# EAGLE schematic NICBP v3 (EAGLE 8.1.0)

## Sheet 1 of 4
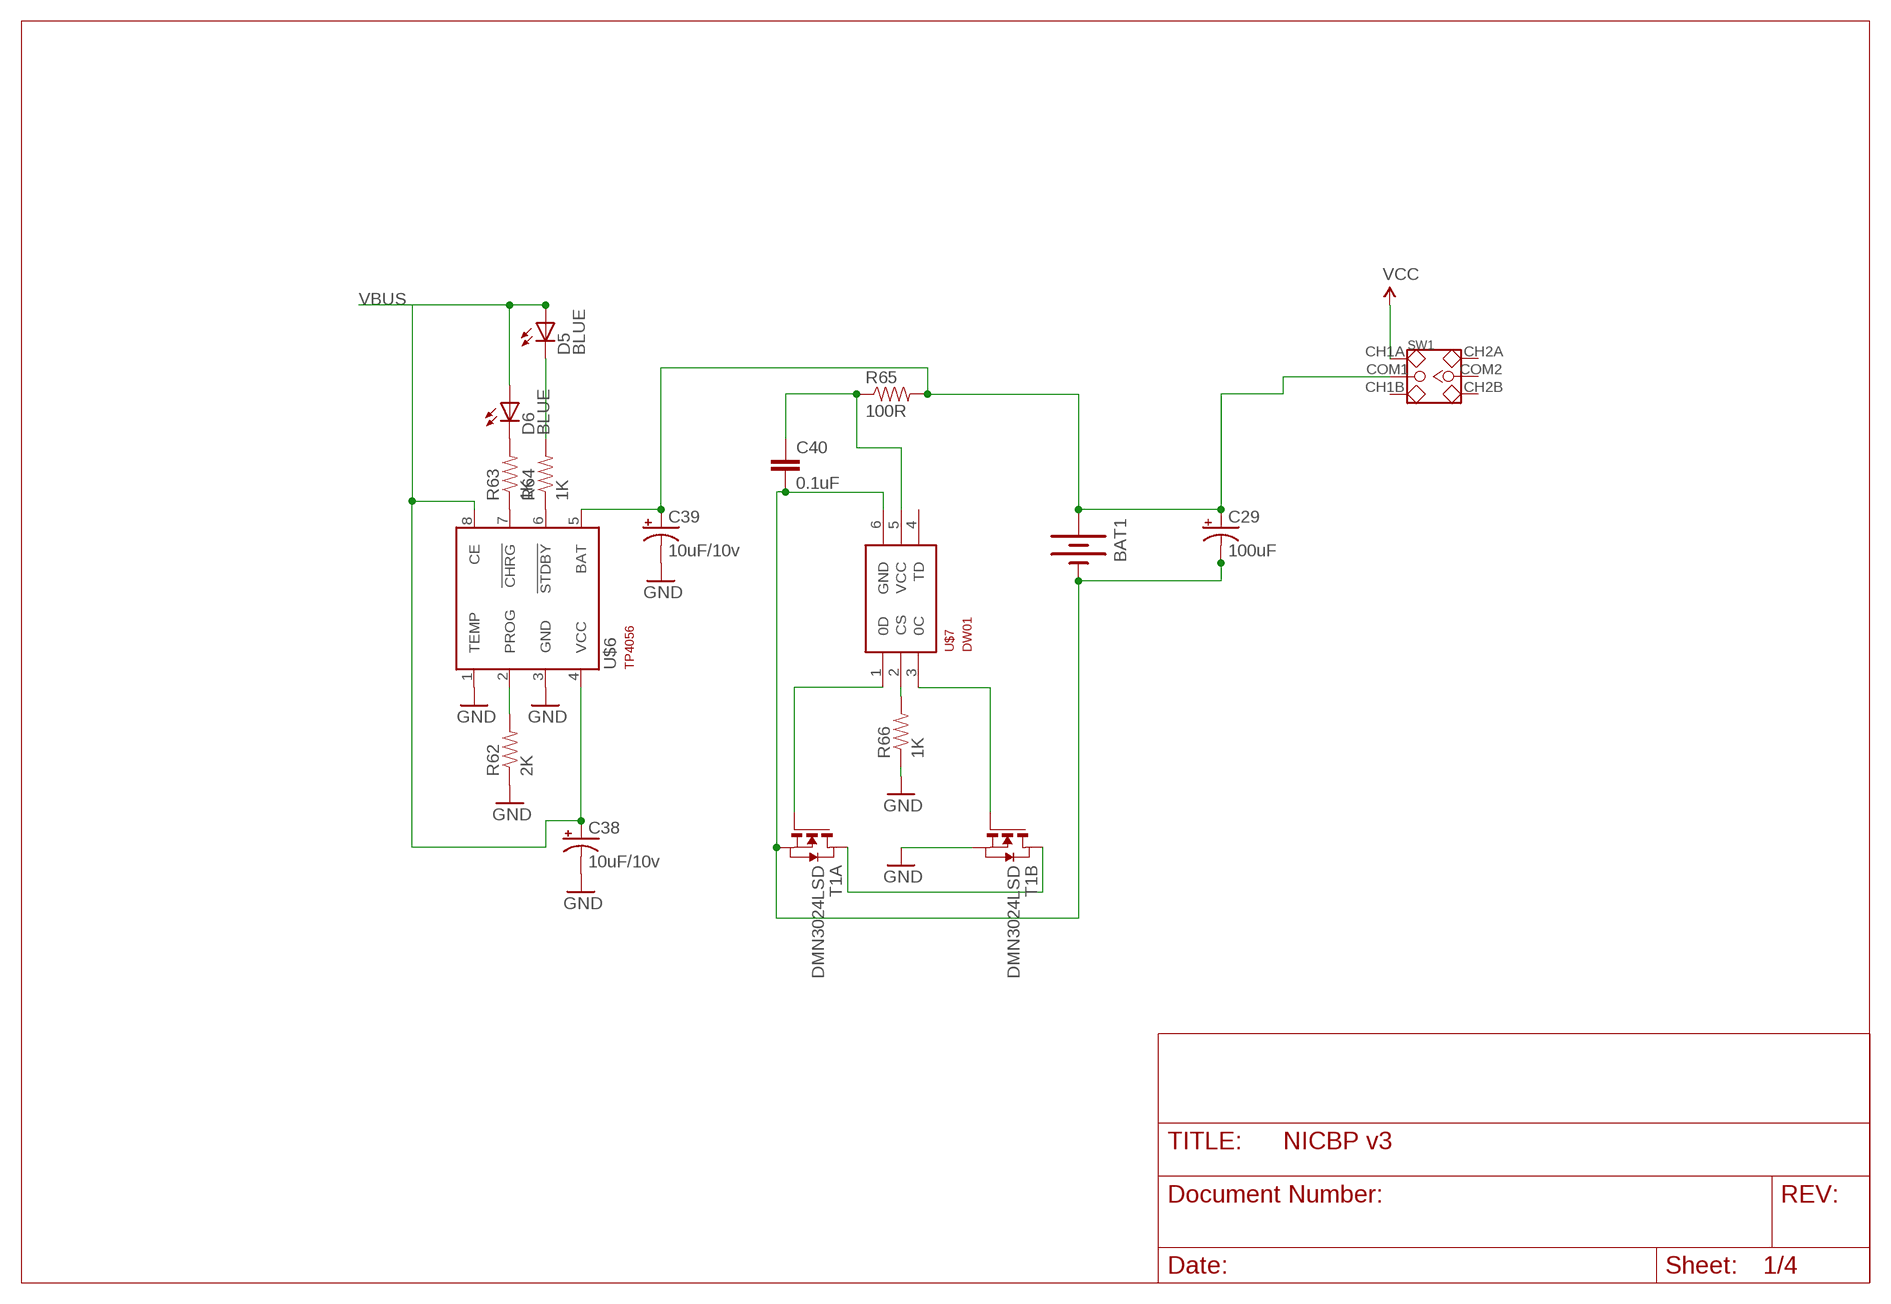
[diagram p0: schematic, sheet 1]

### Parts
BAT1  BATTERYLIPO-TABS  [LIPO-110-TABS]
C29  100uF  CAP_POLF80  [NIPPON_F80]
C38  10uF/10v  CAP_POL1206-KIT  [EIA3216-KIT]
C39  10uF/10v  CAP_POL1206-KIT  [EIA3216-KIT]
C40  0.1uF  0.1UF-100V-10%(0603)  [0603-CAP]
D5  BLUE  LED-BLUE0603  [LED-0603]
D6  BLUE  LED-BLUE0603  [LED-0603]
R62  2K  1KOHM1/10W1%(0603)  [0603-RES]
R63  1K  1KOHM1/10W1%(0603)  [0603-RES]
R64  1K  1KOHM1/10W1%(0603)  [0603-RES]
R65  100R  1KOHM1/10W1%(0603)  [0603-RES]
R66  1K  1KOHM1/10W1%(0603)  [0603-RES]
SW1  SMD-TOGGLE-SWITCH-2CH(2X3P-7X3.5MM)  [SW6-2.54-SMD-7.0X3.5X1.5MM]
T1  DMN3024LSD  [TSSOP-8]
U$6  TP4056  [SOT23-8]
U$7  DW01  [SOT23-6]

### Nets
GND: C38.C(-) C39.C(-) R62.1 R66.1 T1.6(B:S) T1.7(B:S) U$6.1(TEMP) U$6.3(GND) ; also sheet 2,3,4
N$1: BAT1.+ C29.+ C39.A(+) R65.2 SW1.COM1 U$6.5(BAT)
N$58: R62.2 U$6.2(PROG)
N$59: R63.1 U$6.7(!CHRG)
N$60: R64.1 U$6.6(!STDBY)
N$61: D6.C R63.2
N$62: D5.C R64.2
N$65: C40.1 R65.1 U$7.5(VCC)
N$66: BAT1.- C29.- C40.2 T1.2(A:S) T1.3(A:S) U$7.6(GND)
N$67: T1.4(A:G) U$7.1(0D)
N$68: R66.2 U$7.2(CS)
N$69: T1.1(A:D) T1.8(B:D)
N$70: T1.5(B:G) U$7.3(0C)
VBUS: C38.A(+) D5.A D6.A U$6.4(VCC) U$6.8(CE) ; also sheet 2
VCC: SW1.CH1A ; also sheet 2,3,4
Unconnected: SW1.CH1B SW1.CH2A SW1.CH2B SW1.COM2 U$7.4(TD)

## Sheet 2 of 4
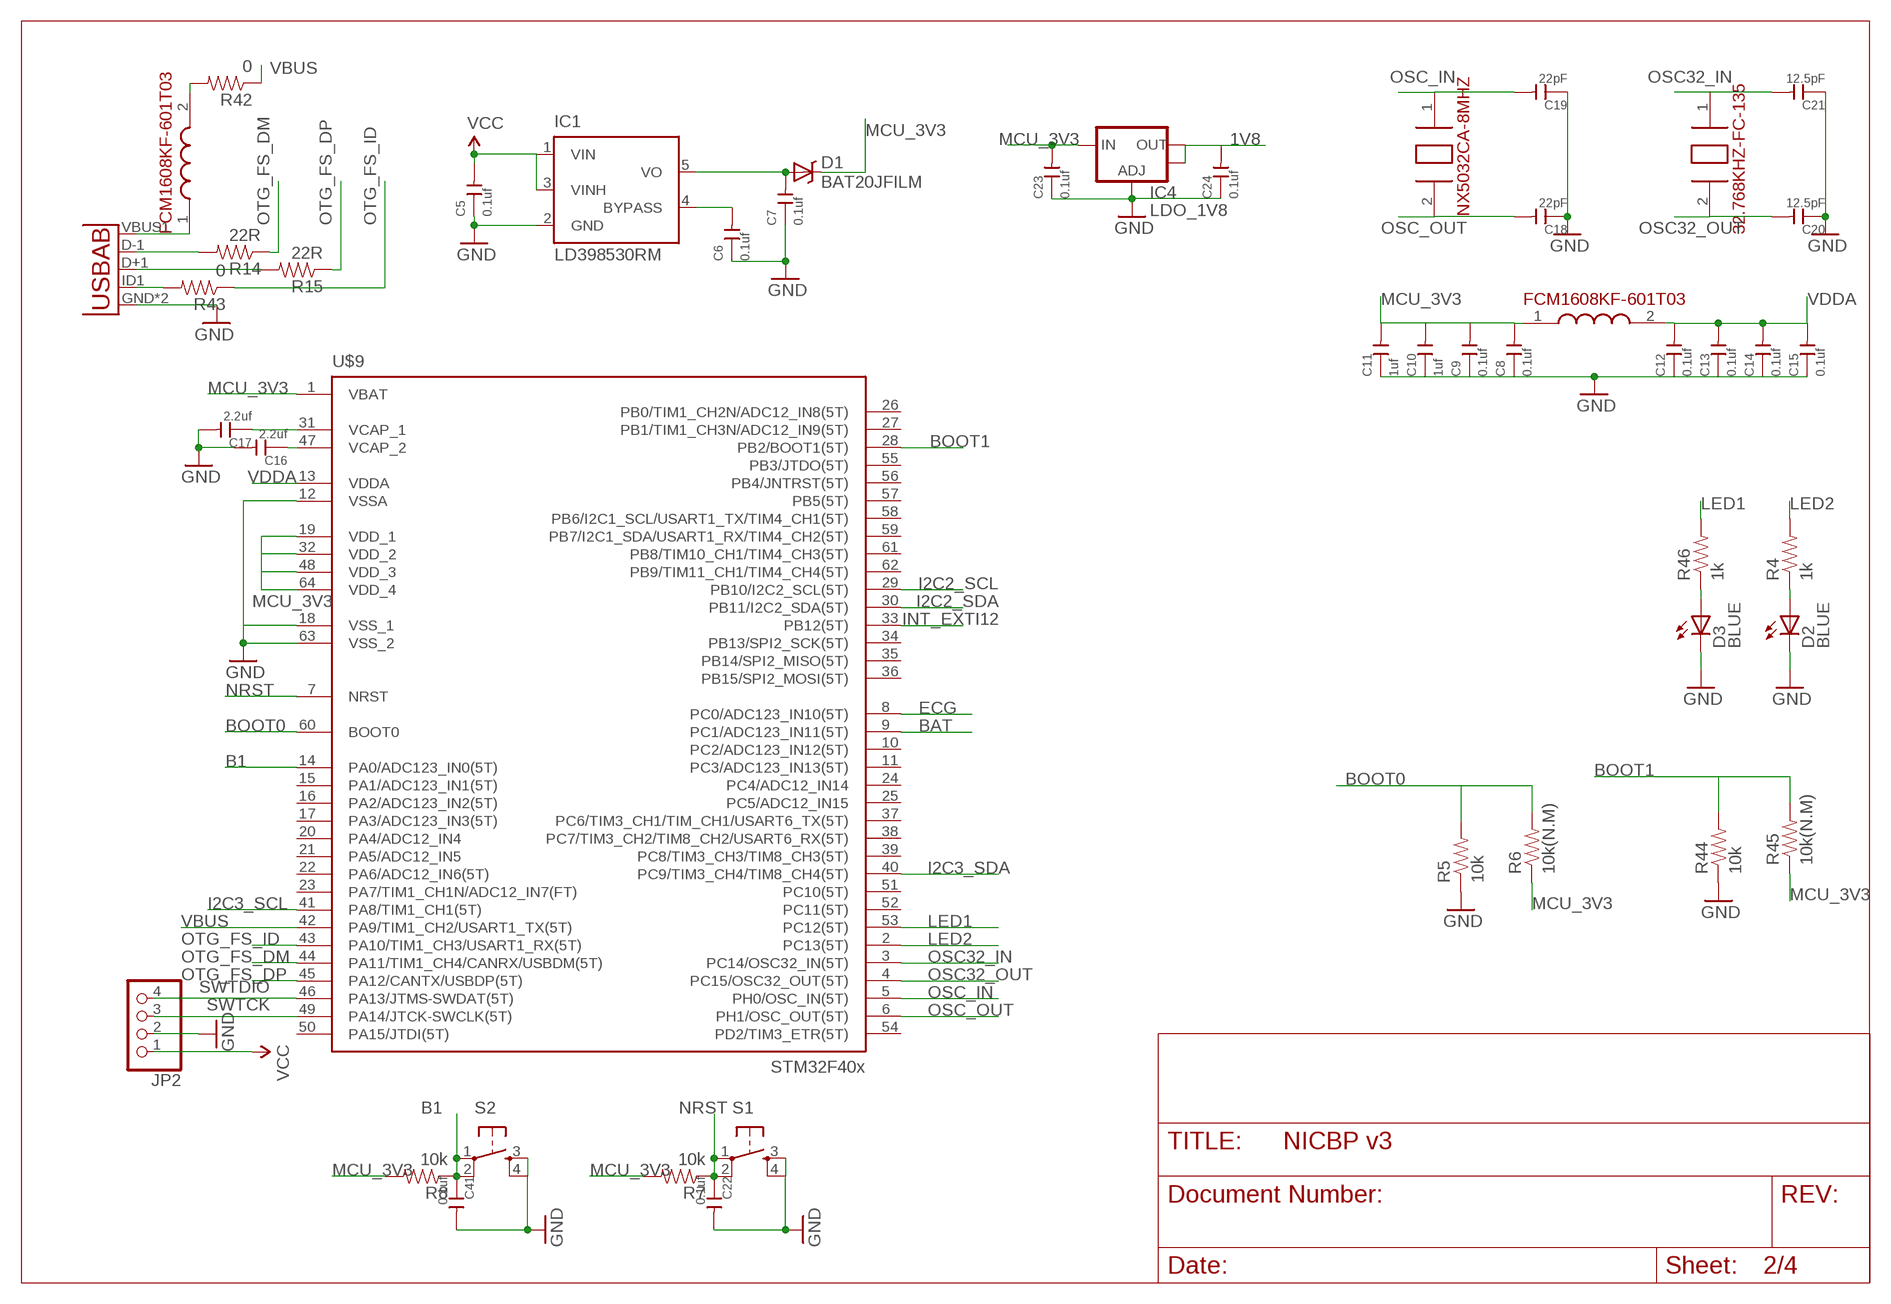
[diagram p1: schematic, sheet 2]

### Parts
C5  0.1uf  CERAMIC-4.7UF-10V-10%-X5R(0603)  [C0603]
C6  0.1uf  CERAMIC-4.7UF-10V-10%-X5R(0603)  [C0603]
C7  0.1uf  CERAMIC-4.7UF-10V-10%-X5R(0603)  [C0603]
C8  0.1uf  CERAMIC-4.7UF-10V-10%-X5R(0603)  [C0603]
C9  0.1uf  CERAMIC-4.7UF-10V-10%-X5R(0603)  [C0603]
C10  1uf  CERAMIC-4.7UF-10V-10%-X5R(0603)  [C0603]
C11  1uf  CERAMIC-4.7UF-10V-10%-X5R(0603)  [C0603]
C12  0.1uf  CERAMIC-4.7UF-10V-10%-X5R(0603)  [C0603]
C13  0.1uf  CERAMIC-4.7UF-10V-10%-X5R(0603)  [C0603]
C14  0.1uf  CERAMIC-4.7UF-10V-10%-X5R(0603)  [C0603]
C15  0.1uf  CERAMIC-4.7UF-10V-10%-X5R(0603)  [C0603]
C16  2.2uf  CERAMIC-4.7UF-10V-10%-X5R(0603)  [C0603]
C17  2.2uf  CERAMIC-4.7UF-10V-10%-X5R(0603)  [C0603]
C18  22pF  CERAMIC-4.7UF-10V-10%-X5R(0603)  [C0603]
C19  22pF  CERAMIC-4.7UF-10V-10%-X5R(0603)  [C0603]
C20  12.5pF  CERAMIC-4.7UF-10V-10%-X5R(0603)  [C0603]
C21  12.5pF  CERAMIC-4.7UF-10V-10%-X5R(0603)  [C0603]
C22  0.1uf  CERAMIC-4.7UF-10V-10%-X5R(0603)  [C0603]
C23  0.1uf  CERAMIC-4.7UF-10V-10%-X5R(0603)  [C0603]
C24  0.1uf  CERAMIC-4.7UF-10V-10%-X5R(0603)  [C0603]
C41  0.1uf  CERAMIC-4.7UF-10V-10%-X5R(0603)  [C0603]
D1  BAT20JFILM  [SOD-323]
D2  BLUE  LED-BLUE0603  [LED-0603]
D3  BLUE  LED-BLUE0603  [LED-0603]
IC1  LD398530RM  [SOT23-5L]
IC4  LDO_1V8  V_REG_LM1117SOT223  [SOT223]
JP2  PINHD-1X4  [1X04]
R4  1k  0OHM1/10W5%(0603)  [0603]
R5  10k  0OHM1/10W5%(0603)  [0603]
R6  10k(N.M)  0OHM1/10W5%(0603)  [0603]
R7  10k  0OHM1/10W5%(0603)  [0603]
R8  10k  0OHM1/10W5%(0603)  [0603]
R14  22R  390OHM1/10W1%(0603)  [0603-RES]
R15  22R  390OHM1/10W1%(0603)  [0603-RES]
R42  0  390OHM1/10W1%(0603)  [0603-RES]
R43  0  390OHM1/10W1%(0603)  [0603-RES]
R44  10k  0OHM1/10W5%(0603)  [0603]
R45  10k(N.M)  0OHM1/10W5%(0603)  [0603]
R46  1k  0OHM1/10W5%(0603)  [0603]
S1  TAC_SWITCHSMD  [TACTILE_SWITCH_SMD]
S2  TAC_SWITCHSMD  [TACTILE_SWITCH_SMD]
U1  USB""  [USB-MICRO-SMD]
U$2  NX5032CA-8MHZ  [NX5032CA-8MHZ]
U$3  FCM1608KF-601T03  [FCM1608KF-601T03]
U$4  32.768KHZ-FC-135  [32.768KHZ-FC-135]
U$9  STM32F405R  [TQFP64]
U$15  FCM1608KF-601T03  [FCM1608KF-601T03]

### Nets
1V8: C24.2 IC4.2(OUT) IC4.4(OUT) ; also sheet 4
B1: C41.1 R8.1 S2.1 S2.2 U$9.14(PA0/ADC123_IN0(5T))
BAT: U$9.9(PC1/ADC123_IN11(5T)) ; also sheet 3
BOOT0: R5.2 R6.2 U$9.60(BOOT0)
BOOT1: R44.2 R45.2 U$9.28(PB2/BOOT1(5T))
ECG: U$9.8(PC0/ADC123_IN10(5T)) ; also sheet 3
GND: C5.1 C6.1 C7.1 C8.1 C9.1 C10.1 C11.1 C12.1 C13.1 C14.1 C15.1 C16.2 C17.2 C18.1 C19.1 C20.1 C21.1 C22.2 C23.1 C24.1 C41.2 D2.C D3.C IC1.2(GND) IC4.1(ADJ) JP2.2 R5.1 R44.1 S1.3 S1.4 S2.3 S2.4 U1.GND U1.GND1(GND) U$9.12(VSSA) U$9.18(VSS_1) U$9.63(VSS_2) ; also sheet 1,3,4
I2C2_SCL: U$9.29(PB10/I2C2_SCL(5T)) ; also sheet 4
I2C2_SDA: U$9.30(PB11/I2C2_SDA(5T)) ; also sheet 4
I2C3_SCL: U$9.41(PA8/TIM1_CH1(5T)) ; also sheet 4
I2C3_SDA: U$9.40(PC9/TIM3_CH4/TIM8_CH4(5T)) ; also sheet 4
INT_EXTI12: U$9.33(PB12(5T)) ; also sheet 4
LED1: R46.2 U$9.53(PC12(5T))
LED2: R4.2 U$9.2(PC13(5T))
MCU_3V3: C8.2 C9.2 C10.2 C11.2 C23.2 D1.1(C) IC4.3(IN) R6.1 R7.2 R8.2 R45.1 U$3.1(1.IN) U$9.1(VBAT) U$9.19(VDD_1) U$9.32(VDD_2) U$9.48(VDD_3) U$9.64(VDD_4) ; also sheet 3,4
N$2: D2.A R4.1
N$3: C17.1 U$9.31(VCAP_1)
N$5: C16.1 U$9.47(VCAP_2)
N$6: C6.2 IC1.4(BYPASS)
N$7: C7.2 D1.2(A) IC1.5(VO)
N$13: R14.2 U1.D-1(D-)
N$23: R15.2 U1.D+1(D+)
N$45: R43.2 U1.ID1(USBID)
N$46: U1.VBUS1(VBUS) U$15.1(1.IN)
N$47: R42.2 U$15.2(2.OUT)
N$48: D3.A R46.1
NRST: C22.1 R7.1 S1.1 S1.2 U$9.7(NRST)
OSC32_IN: C21.2 U$4.1(1.XIN) U$9.3(PC14/OSC32_IN(5T))
OSC32_OUT: C20.2 U$4.2(2.XIN) U$9.4(PC15/OSC32_OUT(5T))
OSC_IN: C19.2 U$2.1(1.XIN) U$9.5(PH0/OSC_IN(5T))
OSC_OUT: C18.2 U$2.2(2.XOUT) U$9.6(PH1/OSC_OUT(5T))
OTG_FS_DM: R14.1 U$9.44(PA11/TIM1_CH4/CANRX/USBDM(5T))
OTG_FS_DP: R15.1 U$9.45(PA12/CANTX/USBDP(5T))
OTG_FS_ID: R43.1 U$9.43(PA10/TIM1_CH3/USART1_RX(5T))
SWTCK: JP2.3 U$9.49(PA14/JTCK-SWCLK(5T))
SWTDIO: JP2.4 U$9.46(PA13/JTMS-SWDAT(5T))
VBUS: R42.1 U$9.42(PA9/TIM1_CH2/USART1_TX(5T)) ; also sheet 1
VCC: C5.2 IC1.1(VIN) IC1.3(VINH) JP2.1 ; also sheet 1,3,4
VDDA: C12.2 C13.2 C14.2 C15.2 U$3.2(2.OUT) U$9.13(VDDA)
Unconnected: U$9.10(PC2/ADC123_IN12(5T)) U$9.11(PC3/ADC123_IN13(5T)) U$9.15(PA1/ADC123_IN1(5T)) U$9.16(PA2/ADC123_IN2(5T)) U$9.17(PA3/ADC123_IN3(5T)) U$9.20(PA4/ADC12_IN4) U$9.21(PA5/ADC12_IN5) U$9.22(PA6/ADC12_IN6(5T)) U$9.23(PA7/TIM1_CH1N/ADC12_IN7(FT)) U$9.24(PC4/ADC12_IN14) U$9.25(PC5/ADC12_IN15) U$9.26(PB0/TIM1_CH2N/ADC12_IN8(5T)) U$9.27(PB1/TIM1_CH3N/ADC12_IN9(5T)) U$9.34(PB13/SPI2_SCK(5T)) U$9.35(PB14/SPI2_MISO(5T)) U$9.36(PB15/SPI2_MOSI(5T)) U$9.37(PC6/TIM3_CH1/TIM_CH1/USART6_TX(5T)) U$9.38(PC7/TIM3_CH2/TIM8_CH2/USART6_RX(5T)) U$9.39(PC8/TIM3_CH3/TIM8_CH3(5T)) U$9.50(PA15/JTDI(5T)) U$9.51(PC10(5T)) U$9.52(PC11(5T)) U$9.54(PD2/TIM3_ETR(5T)) U$9.55(PB3/JTDO(5T)) U$9.56(PB4/JNTRST(5T)) U$9.57(PB5(5T)) U$9.58(PB6/I2C1_SCL/USART1_TX/TIM4_CH1(5T)) U$9.59(PB7/I2C1_SDA/USART1_RX/TIM4_CH2(5T)) U$9.61(PB8/TIM10_CH1/TIM4_CH3(5T)) U$9.62(PB9/TIM11_CH1/TIM4_CH4(5T))

## Sheet 3 of 4
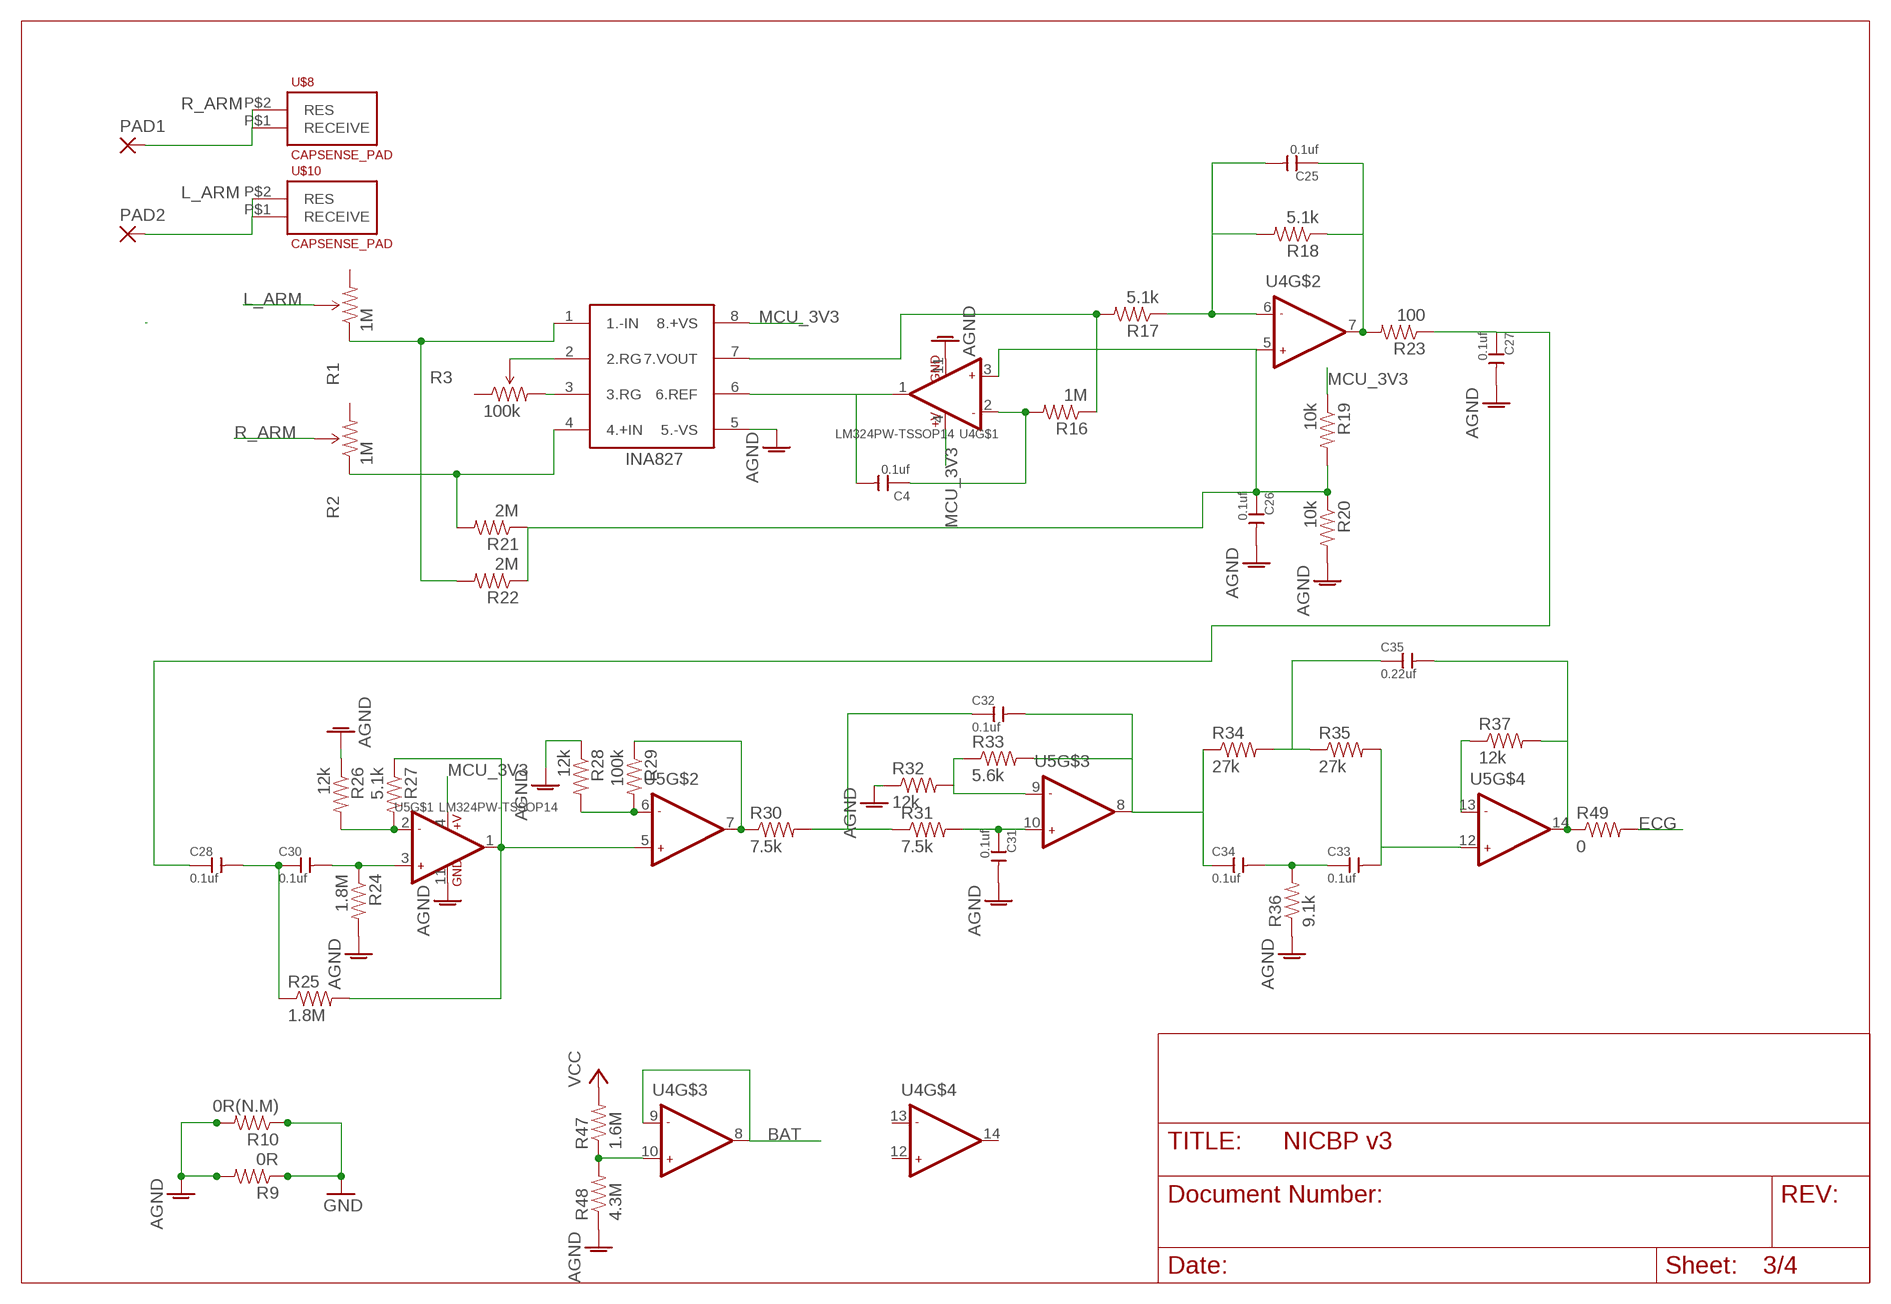
[diagram p2: schematic, sheet 3]

### Parts
C4  0.1uf  CERAMIC-4.7UF-10V-10%-X5R(0603)  [C0603]
C25  0.1uf  CERAMIC-4.7UF-10V-10%-X5R(0603)  [C0603]
C26  0.1uf  CERAMIC-4.7UF-10V-10%-X5R(0603)  [C0603]
C27  0.1uf  CERAMIC-4.7UF-10V-10%-X5R(0603)  [C0603]
C28  0.1uf  CERAMIC-4.7UF-10V-10%-X5R(0603)  [C0603]
C30  0.1uf  CERAMIC-4.7UF-10V-10%-X5R(0603)  [C0603]
C31  0.1uf  CERAMIC-4.7UF-10V-10%-X5R(0603)  [C0603]
C32  0.1uf  CERAMIC-4.7UF-10V-10%-X5R(0603)  [C0603]
C33  0.1uf  CERAMIC-4.7UF-10V-10%-X5R(0603)  [C0603]
C34  0.1uf  CERAMIC-4.7UF-10V-10%-X5R(0603)  [C0603]
C35  0.22uf  CERAMIC-4.7UF-10V-10%-X5R(0603)  [C0603]
PAD1  3,17/1,3  [3,17/1,3]
PAD2  3,17/1,3  [3,17/1,3]
R1  1M  TRIMPOT-2  [TRIMPOT_TC33]
R2  1M  TRIMPOT-2  [TRIMPOT_TC33]
R3  100k  TRIMPOT-2  [TRIMPOT_TC33]
R9  0R  0OHM1/10W5%(0603)  [0603]
R10  0R(N.M)  0OHM1/10W5%(0603)  [0603]
R16  1M  0OHM1/10W5%(0603)  [0603]
R17  5.1k  0OHM1/10W5%(0603)  [0603]
R18  5.1k  0OHM1/10W5%(0603)  [0603]
R19  10k  0OHM1/10W5%(0603)  [0603]
R20  10k  0OHM1/10W5%(0603)  [0603]
R21  2M  0OHM1/10W5%(0603)  [0603]
R22  2M  0OHM1/10W5%(0603)  [0603]
R23  100  0OHM1/10W5%(0603)  [0603]
R24  1.8M  0OHM1/10W5%(0603)  [0603]
R25  1.8M  0OHM1/10W5%(0603)  [0603]
R26  12k  0OHM1/10W5%(0603)  [0603]
R27  5.1k  0OHM1/10W5%(0603)  [0603]
R28  12k  0OHM1/10W5%(0603)  [0603]
R29  100k  0OHM1/10W5%(0603)  [0603]
R30  7.5k  0OHM1/10W5%(0603)  [0603]
R31  7.5k  0OHM1/10W5%(0603)  [0603]
R32  12k  0OHM1/10W5%(0603)  [0603]
R33  5.6k  0OHM1/10W5%(0603)  [0603]
R34  27k  0OHM1/10W5%(0603)  [0603]
R35  27k  0OHM1/10W5%(0603)  [0603]
R36  9.1k  0OHM1/10W5%(0603)  [0603]
R37  12k  0OHM1/10W5%(0603)  [0603]
R47  1.6M  0OHM1/10W5%(0603)  [0603]
R48  4.3M  0OHM1/10W5%(0603)  [0603]
R49  0  0OHM1/10W5%(0603)  [0603]
U4  LM324PW-TSSOP14  AMPLIFIER-LM324PW(TSSOP14)  [TSSOP14-0.65-5X4.4MM]
U5  LM324PW-TSSOP14  AMPLIFIER-LM324PW(TSSOP14)  [TSSOP14-0.65-5X4.4MM]
U$5  INA827  [INA827]
U$8  CAPSENSE_PAD  [CAPSENSE_PAD]
U$10  CAPSENSE_PAD  [CAPSENSE_PAD]

### Nets
ADC1: C35.2 R37.2 R49.1 U5.14(OUT2)
AGND: C26.2 C27.2 C31.2 R9.2 R10.2 R20.2 R24.2 R26.1 R28.1 R32.1 R36.1 R48.1 U4.11(GND) U5.11(GND) U$5.5(5.-VS)
BAT: U4.8(OUT2) U4.9(-IN2) ; also sheet 2
ECG: R49.2 ; also sheet 2
GND: R9.1 R10.1 ; also sheet 1,2,4
L_ARM: PAD2.1(P) R1.2(WIPER) U$10.P$1(RECEIVE) U$10.P$2(RES)
MCU_3V3: R19.1 U4.4(+V) U5.4(+V) U$5.8(8.+VS) ; also sheet 2,4
N$8: C27.1 C28.1 R23.1
N$9: R47.1 R48.2 U4.10(+IN2)
N$14: R3.3(CW) U$5.3(3.RG)
N$15: R3.2(WIPER) U$5.2(2.RG)
N$16: R1.1(CCW) R22.2 U$5.1(1.-IN)
N$17: R2.1(CCW) R21.2 U$5.4(4.+IN)
N$18: C4.2 U4.1(OUT1) U$5.6(6.REF)
N$19: C4.1 R16.2 U4.2(-IN1)
N$20: R16.1 R17.2 U$5.7(7.VOUT)
N$21: C25.2 R17.1 R18.2 U4.6(-IN2)
N$22: C25.1 R18.1 R23.2 U4.7(OUT2)
N$24: C26.1 R19.2 R20.1 R21.1 R22.1 U4.3(+IN1) U4.5(+IN2)
N$25: R26.2 R27.2 U5.2(-IN1)
N$26: R25.2 R27.1 U5.1(OUT1) U5.5(+IN2)
N$27: C30.2 R24.1 U5.3(+IN1)
N$28: C28.2 C30.1 R25.1
N$29: R28.2 R29.2 U5.6(-IN2)
N$30: R29.1 R30.1 U5.7(OUT2)
N$31: C32.1 R30.2 R31.1
N$32: C31.1 R31.2 U5.10(+IN2)
N$33: C32.2 C34.1 R33.2 R34.1 U5.8(OUT2)
N$34: R32.2 R33.1 U5.9(-IN2)
N$35: C35.1 R34.2 R35.1
N$36: C33.1 C34.2 R36.2
N$37: C33.2 R35.2 U5.12(+IN2)
N$38: R37.1 U5.13(-IN2)
R_ARM: PAD1.1(P) R2.2(WIPER) U$8.P$1(RECEIVE) U$8.P$2(RES)
VCC: R47.2 ; also sheet 1,2,4
Unconnected: R1.3(CW) R2.3(CW) R3.1(CCW) U4.12(+IN2) U4.13(-IN2) U4.14(OUT2)

## Sheet 4 of 4
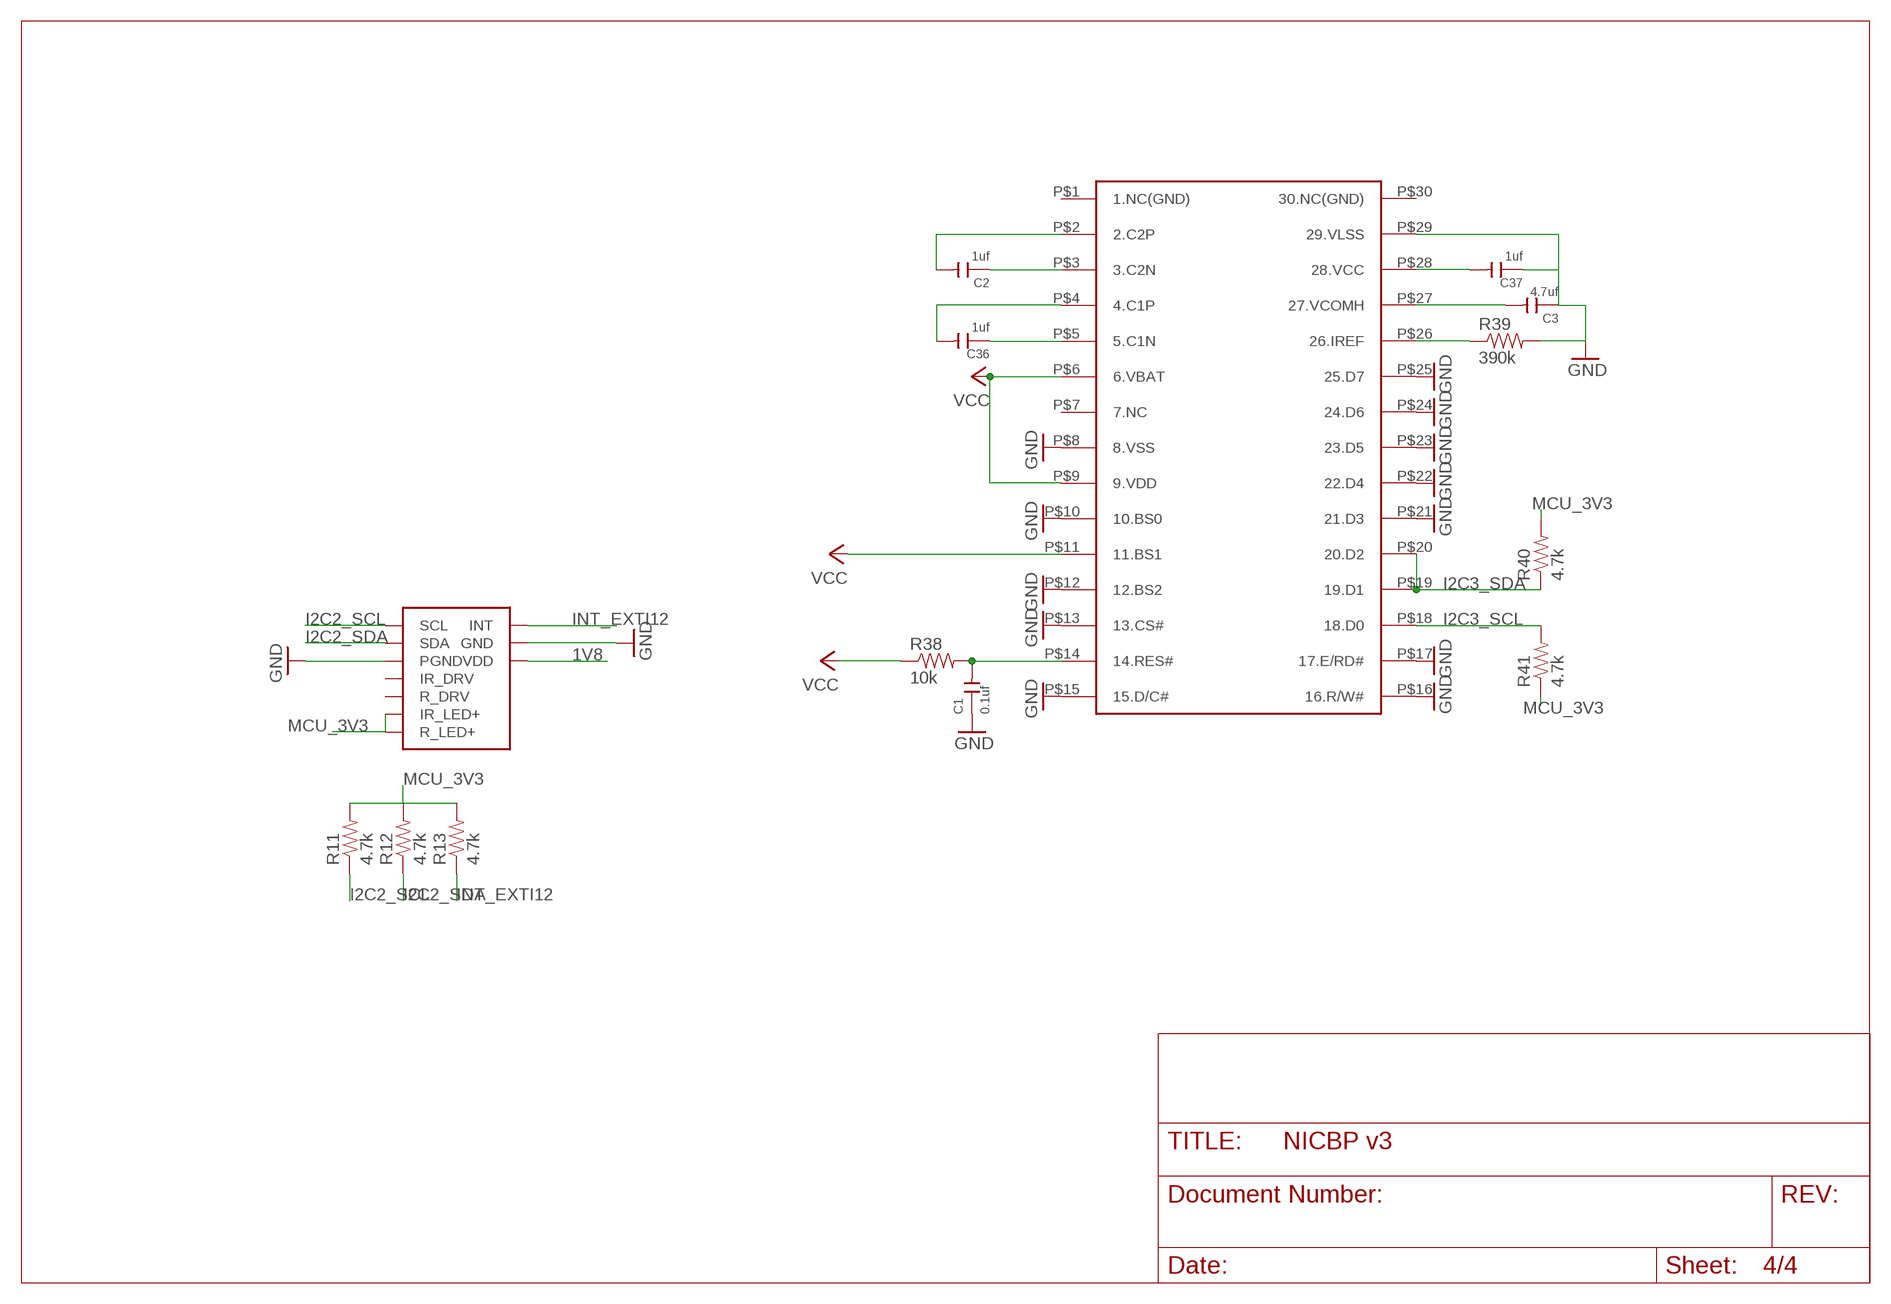
[diagram p3: schematic, sheet 4]

### Parts
C1  0.1uf  CERAMIC-4.7UF-10V-10%-X5R(0603)  [C0603]
C2  1uf  CERAMIC-4.7UF-10V-10%-X5R(0603)  [C0603]
C3  4.7uf  CERAMIC-4.7UF-10V-10%-X5R(0603)  [C0603]
C36  1uf  CERAMIC-4.7UF-10V-10%-X5R(0603)  [C0603]
C37  1uf  CERAMIC-4.7UF-10V-10%-X5R(0603)  [C0603]
R11  4.7k  0OHM1/10W5%(0603)  [0603]
R12  4.7k  0OHM1/10W5%(0603)  [0603]
R13  4.7k  0OHM1/10W5%(0603)  [0603]
R38  10k  0OHM1/10W5%(0603)  [0603]
R39  390k  0OHM1/10W5%(0603)  [0603]
R40  4.7k  0OHM1/10W5%(0603)  [0603]
R41  4.7k  0OHM1/10W5%(0603)  [0603]
U$12  MAX30100  [MAX30100]
U$13  ER-OLED0.96  [ER-OLED0.96]

### Nets
1V8: U$12.11(VDD) ; also sheet 2
GND: C1.1 C3.1 C37.1 R39.2 U$12.4(PGND) U$12.12(GND) U$13.P$8(8.VSS) U$13.P$10(10.BS0) U$13.P$12(12.BS2) U$13.P$13(13.CS#) U$13.P$15(15.D/C#) U$13.P$16(16.R/W#) U$13.P$17(17.E/RD#) U$13.P$21(21.D3) U$13.P$22(22.D4) U$13.P$23(23.D5) U$13.P$24(24.D6) U$13.P$25(25.D7) U$13.P$29(29.VLSS) ; also sheet 1,2,3
I2C2_SCL: R11.1 U$12.2(SCL) ; also sheet 2
I2C2_SDA: R12.1 U$12.3(SDA) ; also sheet 2
I2C3_SCL: R41.2 U$13.P$18(18.D0) ; also sheet 2
I2C3_SDA: R40.1 U$13.P$19(19.D1) U$13.P$20(20.D2) ; also sheet 2
INT_EXTI12: R13.1 U$12.13(INT) ; also sheet 2
MCU_3V3: R11.2 R12.2 R13.2 R40.2 R41.1 U$12.9(R_LED+) U$12.10(IR_LED+) ; also sheet 2,3
N$11: C1.2 R38.2 U$13.P$14(14.RES#)
N$12: C2.1 U$13.P$3(3.C2N)
N$39: C36.1 U$13.P$5(5.C1N)
N$40: C2.2 U$13.P$2(2.C2P)
N$41: C36.2 U$13.P$4(4.C1P)
N$42: R39.1 U$13.P$26(26.IREF)
N$43: C3.2 U$13.P$27(27.VCOMH)
N$44: C37.2 U$13.P$28(28.VCC)
VCC: R38.1 U$13.P$6(6.VBAT) U$13.P$9(9.VDD) U$13.P$11(11.BS1) ; also sheet 1,2,3
Unconnected: U$12.5(IR_DRV) U$12.6(R_DRV) U$13.P$1(1.NC(GND)) U$13.P$7(7.NC) U$13.P$30(30.NC(GND))

## Library data of the parts
BAT1 = SparkFun-Electromechanical:BATTERY: Battery Holders Various common sizes : AA, AAA, 20mm coin cell and 12mm coin cell. 20MM_4LEGS, BATT-10373
C1 C2 C4-C28 C30-C37 C41 = Seeed-OPL-Capacitor:CERAMIC-4.7UF-10V-10%-X5R(0603): 302010111; MPN: CC0603KRX5R6BB475; VALUE: 4.7uf
C3 = Seeed-OPL-Capacitor:CERAMIC-4.7UF-10V-10%-X5R(0603): 302010111; MPN: CC0603KRX5R6BB475
C29 C38 C39 = SparkFun-Capacitors:CAP_POL: Capacitor Polarized These are standard SMD and PTH capacitors. Normally 10uF, 47uF, and 100uF in electrolytic and tantalum varieties. Always verify the external diameter of the through hole cap, it varies with capacity, voltage, and manufacturer. The EIA devices should be standard.
C40 = SparkFun-Capacitors:0.1UF-100V-10%(0603): CAP-08390; PROD_ID: CAP-08390
D1 = SparkFun-DiscreteSemi:BAT20JFILM: 23V, 1A Schottky diode, SOD-323 package; PROD_ID: DIO-11623
D2 D3 D5 D6 = SparkFun-LED:LED-BLUE: Blue LEDs for production use Various blue LEDs stocked by SparkFun production 0603 - DIO-08575 Rebel - DIO-09553 1206 - DIO-09911; PROD_ID: DIO-08575
IC1 = st-microelectronics:LD3985: Ultra low drop and low noise BiCMOS voltage regulators Source: www.st.com LD3985.pdf
IC4 = SparkFun-PowerIC:V_REG_LM1117: Voltage Regulator LM1117 Standard adjustable voltage regulator but in SMD form. Spark Fun Electronics SKU : COM-00595
JP2 = pinhead:PINHD-1X4: PIN HEADER
PAD1 PAD2 = wirepad:3,17/1,3: THROUGH-HOLE PAD
R1-R3 = SparkFun-Electromechanical:TRIMPOT: Various small potentiometers for "set-and-forget" applications
R4-R13 R16-R41 R44-R48 = SparkFun-Resistors:0OHM1/10W5%(0603): RES-08609; PROD_ID: RES-08609; VALUE: 0
R14 R15 R42 R43 = SparkFun-Resistors:390OHM1/10W1%(0603): RES-07864; PROD_ID: RES-07864; VALUE: 390
R49 = SparkFun-Resistors:0OHM1/10W5%(0603): RES-08609; PROD_ID: RES-08609
R62 R65 = SparkFun-Resistors:1KOHM1/10W1%(0603): RES-07856; PROD_ID: RES-07856; VALUE: 1K
R63 R64 R66 = SparkFun-Resistors:1KOHM1/10W1%(0603): RES-07856; PROD_ID: RES-07856
S1 S2 = SparkFun-Electromechanical:TAC_SWITCH: Momentary Switch Button commonly used for reset or general input. Spark Fun Electronics SKU : COM-00097 SMT- SWCH-08247; PROD_ID: SWCH-08247
SW1 = Seeed-OPL-Switch:SMD-TOGGLE-SWITCH-2CH(2X3P-7X3.5MM): 311030005
T1 = FS8205A:DMN3024LSD: DUAL N-CHANNEL ENHANCEMENT MODE MOSFET data sheet <http://goo.gl/dRgboR> Dave.Calaway Eagle Library <https://goo.gl/Muy1Tr>
U1 = MicroUSB Long GND:USB: This is a USB AB connector that is compatible with USB OTG. i.e. this connector can serve as a host or device
U4 U5 = Seeed-OPL-ic:AMPLIFIER-LM324PW(TSSOP14): 310020008; MPN: LM324PW
U$2 = NX5032CA-8MHZ:NX5032CA-8MHZ
U$3 U$15 = FCM1608KF-601T03:FCM1608KF-601T03
U$4 = 32.768KHZ-FC-135:32.768KHZ-FC-135
U$5 = INA827:INA827
U$6 = TP4056:TP4056: TP4056 Data sheet <http://goo.gl/J7k8TF> Dave.Calaway Eagle Library <https://goo.gl/Muy1Tr>
U$7 = DW01:DW01: The DW01-P battery protection IC is designed to protect lithium-ion/polymer battery from damage or degrading the lifetime due to overcharge, overdischarge, and/or overcurrent for one-cell lithium-ion/polymer battery powered systems, such as cellular phones. Data sheet <http://goo.gl/4y108d> Dave.Calaway Eagle Library <https://goo.gl/Muy1Tr>
U$8 U$10 = SparkFun-Electromechanical:CAPSENSE_PAD: Generic copper pad for a capacitive touch sensor.
U$9 = stm32f4:STM32F405R: STM32F405 64 pin LQFP reviewed: YES tested: YES
U$12 = MAX30100:MAX30100
U$13 = ER-OLED0.96:ER-OLED0.96